# Altium schematic sheet PLASMA2.SchDoc
size A4; SheetNumber: 2; SheetTotal: 2
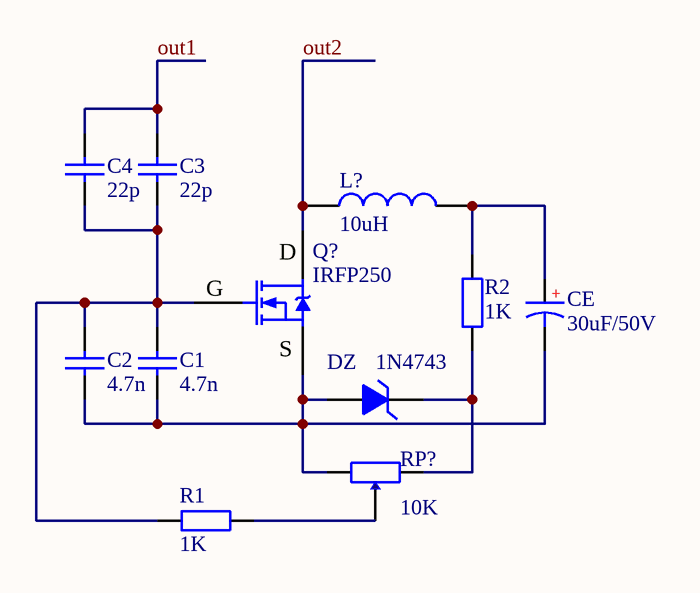
[diagram p0: PLASMA2.SchDoc]

## Parts
C1  4.7n  [C1812_L]
C2  4.7n  [C1812_L]
C3  22p  [C1812_L]
C4  22p  [C1812_L]
CE  30uF/50V  [CE-3.5*8]
DZ  1N4743  [DO-41]
L?  10uH  [AL0204]
Q?  IRFP250  [TO247A]
R1  1K  [R1210_M]
R2  1K  [R1210_M]
RP?  10K  [3296W]

## Nets
out1: C3.2 C4.2
out2: L?.1 Q?.2(D)
NetC1_1: C1.1 C2.1 CE.2 DZ.1(A) Q?.3(S) RP?.3
NetC1_2: C1.2 C2.2 C3.1 C4.1 Q?.1(G) R1.1
NetCE_1: CE.1 L?.2 R2.2
NetDZ_2: DZ.2(K) R2.1 RP?.1
NetR1_2: R1.2 RP?.2

## Notes on the sheet
- (in symbol CE) +

## Library data of the parts
C1-C4 = C: 贴片电容/MLCC电容; BOM名称: 无极性贴片电容; 联系下单店铺卖家 免费帮你查找封装: 联系下单店铺卖家 免费技术指导; 当前库版本V2024.2.3 @淘宝卖家:黄晶宝石: 最新版本发布https://item.taobao.com/item.htm?id=566775463719
CE = CE: 直插电解电容; 联系下单店铺卖家 免费帮你查找封装: 联系下单店铺卖家 免费技术指导; BOM名称: 直插电解电容
DZ = 1N4742: 12V/1W稳压管; 当前库版本V2024.2.3 @淘宝卖家:黄晶宝石: 最新版本发布https://item.taobao.com/item.htm?id=566775463719; BOM名称: 12V/1W稳压管
L? = L-AL: 色环电感; 当前库版本V2024.2.3 @淘宝卖家:黄晶宝石: 最新版本发布https://item.taobao.com/item.htm?id=566775463719; BOM名称: 色环电感
Q? = IRFP250: N沟道 200V/30A; BOM名称: 功率型N沟场效应管; 联系下单店铺卖家 免费帮你查找封装: 联系下单店铺卖家 免费技术支持; 当前库版本V2024.2.3 @淘宝卖家:黄晶宝石: 最新版本发布https://item.taobao.com/item.htm?id=566775463719
R1 R2 = R: 贴片电阻; 联系下单店铺卖家 免费帮你查找封装: 联系下单店铺卖家 免费技术指导; BOM名称: 贴片电阻
RP? = RP: 单联电位器; BOM名称: 插件电位器; 联系下单店铺卖家 免费帮你查找封装: 联系下单店铺卖家 免费技术指导